# EAGLE design SurfaceEEG_V1.2 (EAGLE 7.7.0)
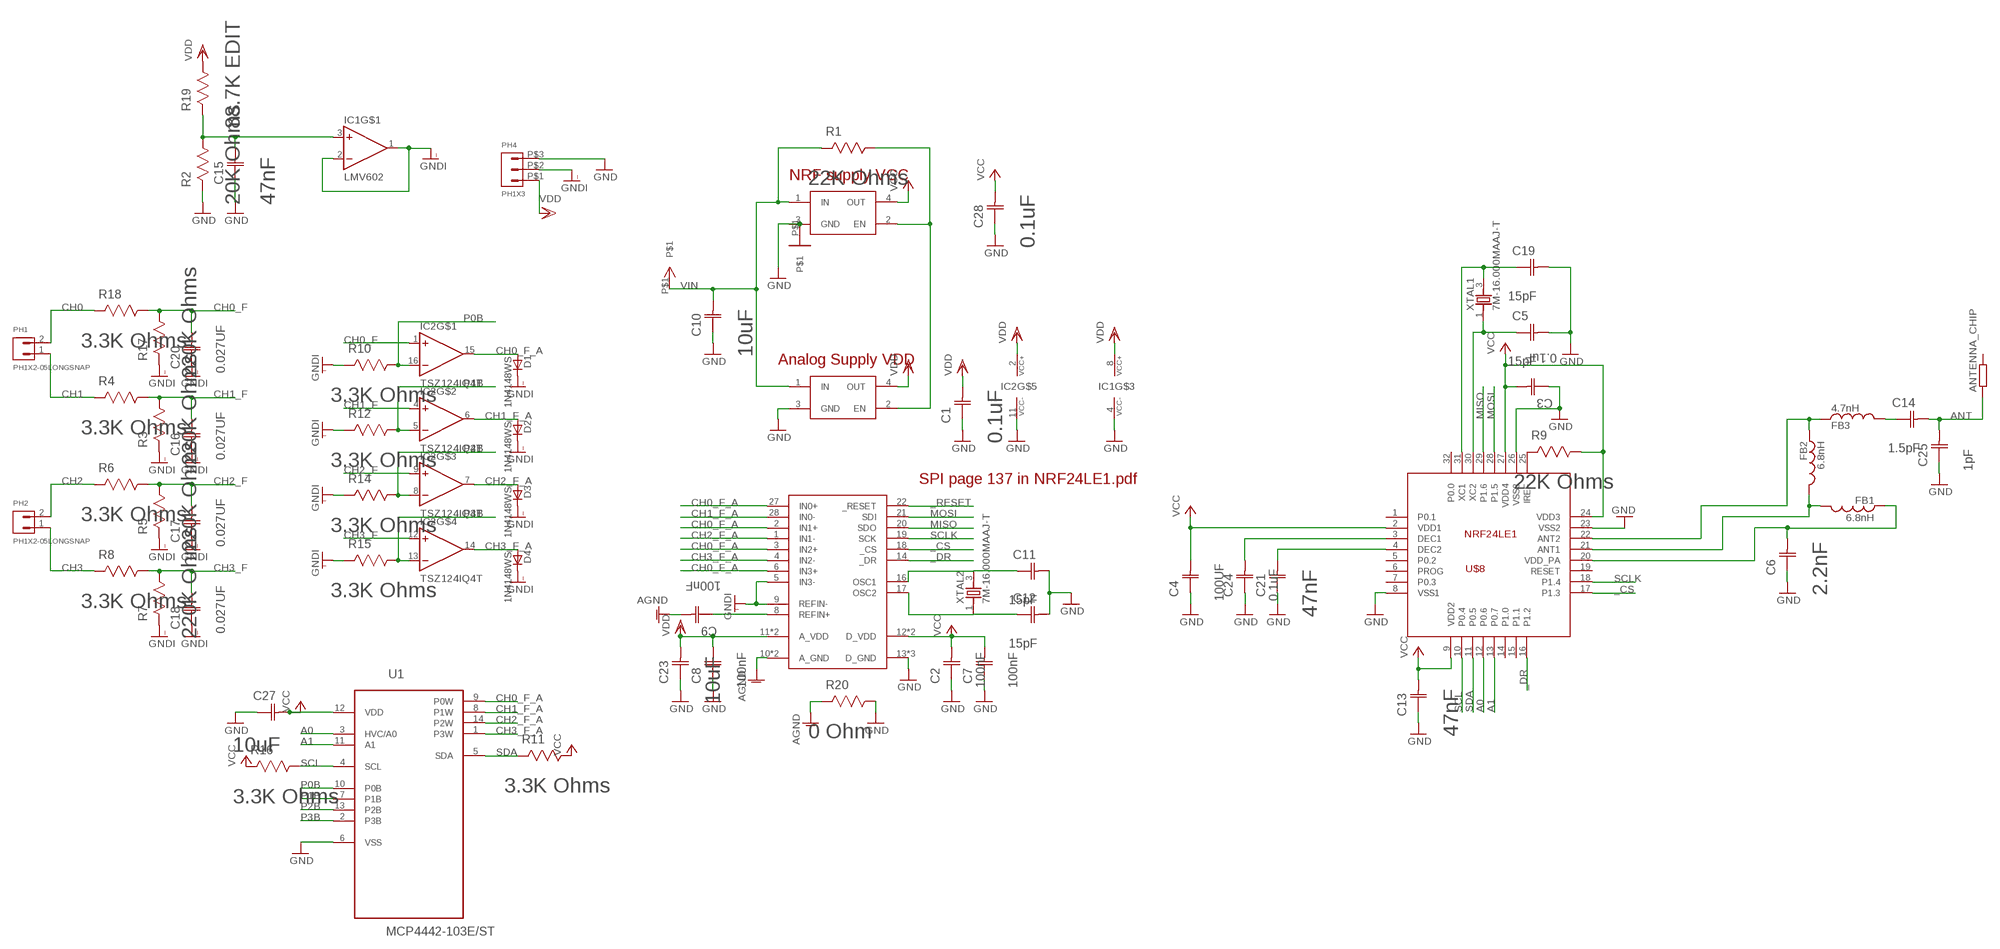
[diagram p0: schematic, sheet 1]

## Parts
ANTENNA_CHIP  R0805  [R0805]
C1  0.1uF  C0603C104K5RAC-TU  [CAPC1608X85N]
C2  100nF  06033C104JAT2A  [CAPC1608X90N]
C3  0.1uF  04023C104KAT2A  [CAPC1005X60N]
C4  100UF  1206YD106MAT2A  [CAPC3216X178N]
C5  15pF  UQCL2A150JAT2A/500  [CAPC1005X60N]
C6  2.2nF  C0402C222K5RACTU  [CAPC1005X60N]
C7  100nF  06033C104JAT2A  [CAPC1608X90N]
C8  100nF  06033C104JAT2A  [CAPC1608X90N]
C9  100nF  06033C104JAT2A  [CAPC1608X90N]
C10  10uF  C0603C106M9PACTU  [CAPC1608X85N]
C11  15pF  UQCL2A150JAT2A/500  [CAPC1005X60N]
C12  15pF  UQCL2A150JAT2A/500  [CAPC1005X60N]
C13  47nF  C0603C473K1RACTU  [CAPC1608X85N]
C14  1.5pF  UQCL2A1R5BAT2A/500  [CAPC1005X60N]
C15  47nF  C0603C473K1RACTU  [CAPC1608X85N]
C16  0.027UF  0603YC273JAT2A  [CAPC1608X90N]
C17  0.027UF  0603YC273JAT2A  [CAPC1608X90N]
C18  0.027UF  0603YC273JAT2A  [CAPC1608X90N]
C19  15pF  UQCL2A150JAT2A/500  [CAPC1005X60N]
C20  0.027UF  0603YC273JAT2A  [CAPC1608X90N]
C21  47nF  C0603C473K1RACTU  [CAPC1608X85N]
C23  10uF  C0603C106M9PACTU  [CAPC1608X85N]
C24  0.1uF  04023C104KAT2A  [CAPC1005X60N]
C25  1pF  UQCL2A1R0BAT2A/500  [CAPC1005X60N]
C27  10uF  C0603C106M9PACTU  [CAPC1608X85N]
C28  0.1uF  C0603C104K5RAC-TU  [CAPC1608X85N]
D1  1N4148WS  [SOD323F]
D2  1N4148WS  [SOD323F]
D3  1N4148WS  [SOD323F]
D4  1N4148WS  [SOD323F]
FB1  6.8nH  FB0402  [FB0402]
FB2  6.8nH  FB0402  [FB0402]
FB3  4.7nH  FB0402  [FB0402]
IC1  LMV602  [VSSOP8]
IC2  TSZ124IQ4T  [QFN16]
PH1  PH1X2-05LONGSNAP  [PHLS005-1-2]
PH2  PH1X2-05LONGSNAP  [PHLS005-1-2]
PH4  PH1X3  [PH005-1-3]
R1  22K Ohms  RC0603FR-0722KL  [RESC1608X60N]
R2  20K Ohms  RC0603FR-0720KL  [RESC1608X60N]
R3  220K Ohms  RC0603FR-07220KL  [RESC1608X60N]
R4  3.3K Ohms  RC0603FR-073K3L  [RESC1608X60N]
R5  220K Ohms  RC0603FR-07220KL  [RESC1608X60N]
R6  3.3K Ohms  RC0603FR-073K3L  [RESC1608X60N]
R7  220K Ohms  RC0603FR-07220KL  [RESC1608X60N]
R8  3.3K Ohms  RC0603FR-073K3L  [RESC1608X60N]
R9  22K Ohms  RC0603FR-0722KL  [RESC1608X60N]
R10  3.3K Ohms  RC0603FR-073K3L  [RESC1608X60N]
R11  3.3K Ohms  RC0603FR-073K3L  [RESC1608X60N]
R12  3.3K Ohms  RC0603FR-073K3L  [RESC1608X60N]
R14  3.3K Ohms  RC0603FR-073K3L  [RESC1608X60N]
R15  3.3K Ohms  RC0603FR-073K3L  [RESC1608X60N]
R16  3.3K Ohms  RC0603FR-073K3L  [RESC1608X60N]
R17  220K Ohms  RC0603FR-07220KL  [RESC1608X60N]
R18  3.3K Ohms  RC0603FR-073K3L  [RESC1608X60N]
R19  88.7K EDIT  RT0603FRE0782KL  [RESC1608X60N]
R20  0 Ohm  9C06031A0R00JLHFT  [RESC1608X60N]
U1  MCP4442-103E/ST  [SOP65P640X120-14N]
U$1  NCP103  [UDFN4-1*1]
U$2  NCP103  [UDFN4-1*1]
U$3  MCP3912  [QFN28]
U$4  VCC  [VCC-PAD]
U$5  GND  [GND-PAD]
U$8  NRF24LE1  [QFN-32]
XTAL1  7M-16.000MAAJ-T  [TXC_7M-16.000MAAJ-T]
XTAL2  7M-16.000MAAJ-T  [TXC_7M-16.000MAAJ-T]

## Nets
_CS: U$3.18(_CS) U$8.17(P1.3)
_DR: U$3.14(_DR) U$8.16(P1.2)
_RESET: U$3.22(_RESET)
A0: U1.3(HVC/A0) U$8.12(P0.6)
A1: U1.11(A1) U$8.13(P0.7)
AGND: C9.2(C2) R20.2(R2) U$3.10(A_GND) U$3.26(A_GND)
ANT: ANTENNA_CHIP.1 C14.1(C2) C25.1(C2)
CH0: PH1.2 R18.2(R2)
CH0_F: C20.2(C2) IC2.1(IN+) R17.1(R1) R18.1(R1)
CH0_F_A: D1.A IC2.15(OUT) U1.9(P0W) U$3.2(IN1+) U$3.3(IN2+) U$3.6(IN3+) U$3.27(IN0+)
CH1: PH1.1 R4.2(R2)
CH1_F: C16.2(C2) IC2.4(IN+) R3.1(R1) R4.1(R1)
CH1_F_A: D2.A IC2.6(OUT) U1.8(P1W) U$3.28(IN0-)
CH2: PH2.2 R6.2(R2)
CH2_F: C17.2(C2) IC2.9(IN+) R5.1(R1) R6.1(R1)
CH2_F_A: D3.A IC2.7(OUT) U1.14(P2W) U$3.1(IN1-)
CH3: PH2.1 R8.2(R2)
CH3_F: C18.2(C2) IC2.12(IN+) R7.1(R1) R8.1(R1)
CH3_F_A: D4.A IC2.14(OUT) U1.1(P3W) U$3.4(IN2-)
GND: C1.1(C1) C2.1(C1) C3.2(C1) C4.1(C1) C5.1(C2) C6.1(C1) C7.1(C1) C8.1(C1) C10.1(C1) C11.1(C2) C12.1(C2) C13.1(C1) C15.1(C1) C19.1(C2) C21.1(C1) C23.1(C1) C24.2(C1) C25.2(C1) C27.1(C1) C28.1(C1) IC1.4(VCC-) IC2.11(VCC-) PH4.P$3 R2.2(R2) R20.1(R1) U1.6(VSS) U$1.3(GND) U$2.3(GND) U$3.13(D_GND) U$3.15(D_GND) U$3.23(D_GND) U$5.P$1 U$8.8(VSS1) U$8.23(VSS2) U$8.26(VSS3)
GNDI: C16.1(C1) C17.1(C1) C18.1(C1) C20.1(C1) D1.C D2.C D3.C D4.C IC1.1(OUT) IC1.2(IN-) PH4.P$2 R3.2(R2) R5.2(R2) R7.2(R2) R10.2(R2) R12.2(R2) R14.2(R2) R15.2(R2) R17.2(R2) U$3.5(IN3-) U$3.9(REFIN-)
MISO: U$3.20(SDO) U$8.29(P1.6)
MOSI: U$3.21(SDI) U$8.28(P1.5)
N$1: FB2.1 FB3.1 U$8.22(ANT2)
N$2: C24.1(C2) U$8.3(DEC1)
N$3: C21.2(C2) U$8.4(DEC2)
N$4: C6.2(C2) FB1.1 U$8.20(VDD_PA)
N$5: R1.1(R1) U$1.2(EN) U$2.2(EN)
N$6: R9.2(R2) U$8.25(IREF)
N$7: FB1.2 FB2.2 U$8.21(ANT1)
N$10: C5.2(C1) U$8.30(XC2) XTAL1.1
N$11: C19.2(C1) U$8.31(XC1) XTAL1.3
N$12: C9.1(C1) U$3.8(REFIN+)
N$14: C11.2(C1) U$3.16(OSC1) XTAL2.3
N$15: C12.2(C1) U$3.17(OSC2) XTAL2.1
N$18: C15.2(C2) IC1.3(IN+) R2.1(R1) R19.2(R2)
N$22: C14.2(C1) FB3.2
P0B: IC2.16(IN-) R10.1(R1) U1.10(P0B)
P1B: IC2.5(IN-) R12.1(R1) U1.7(P1B)
P2B: IC2.8(IN-) R14.1(R1) U1.13(P2B)
P3B: IC2.13(IN-) R15.1(R1) U1.2(P3B)
SCL: R16.1(R1) U1.4(SCL) U$8.10(P0.4)
SCLK: U$3.19(SCK) U$8.18(P1.4)
SDA: R11.2(R2) U1.5(SDA) U$8.11(P0.5)
VCC: C2.2(C2) C3.1(C2) C4.2(C2) C7.2(C2) C13.2(C2) C27.2(C2) C28.2(C2) R9.1(R1) R11.1(R1) R16.2(R2) U1.12(VDD) U$1.4(OUT) U$3.12(D_VDD) U$3.24(D_VDD) U$8.2(VDD1) U$8.9(VDD2) U$8.24(VDD3) U$8.27(VDD4)
VDD: C1.2(C2) C8.2(C2) C23.2(C2) IC1.8(VCC+) IC2.2(VCC+) PH4.P$1 R19.1(R1) U$2.4(OUT) U$3.11(A_VDD) U$3.25(A_VDD)
VIN: C10.2(C2) R1.2(R2) U$1.1(IN) U$2.1(IN) U$4.P$1
Unconnected: ANTENNA_CHIP.2 IC1.5(IN+) IC1.6(IN-) IC1.7(OUT) U$8.1(P0.1) U$8.5(P0.2) U$8.6(PROG) U$8.7(P0.3) U$8.14(P1.0) U$8.15(P1.1) U$8.19(RESET) U$8.32(P0.0)

## Notes on the sheet
- NRF supply VCC
- Analog Supply VDD
- SPI page 137 in NRF24LE1.pdf

## Library data of the parts
ANTENNA_CHIP = ELL-i-Passives:R: Surface Mount Resistor — in standard sizes
C1 C28 = (manufact)-Kemet-element14:C0603C104K5RAC-TU: CAPACITOR, 0603; MPN: C0603C104K5RAC-TU; OC_FARNELL: 1692286; OC_NEWARK: 97H5226; SUPPLIER: Kemet; TOLERANCE: ±10%; VOLTAGERATING: 50V
C2 C7-C9 = (manufact)-capacitors-AVX-element14:06033C104JAT2A: Capacitor 0603; MPN: 06033C104JAT2A; OC_FARNELL: 1740614; OC_NEWARK: 60R6215; SUPPLIER: AVX; TOLERANCE: ±5%; VOLTAGERATING: 25V
C3 C24 = (manufact)-capacitors-AVX-element14:04023C104KAT2A: Capacitor 0402; MPN: 04023C104KAT2A; OC_FARNELL: 1867948; OC_NEWARK: 37T9047; SUPPLIER: AVX; TOLERANCE: ±10%; VOLTAGERATING: 25V
C4 = (manufact)-capacitors-AVX-element14:1206YD106MAT2A: Capacitor 1206; MPN: 1206YD106MAT2A; OC_FARNELL: 1582746; OC_NEWARK: 96M1430; SUPPLIER: AVX; TOLERANCE: ±20%; VALUE: 10UF; VOLTAGERATING: 16V
C5 C11 C12 C19 = (manufact)-capacitors-AVX-element14:UQCL2A150JAT2A/500: Capacitor 0402; MPN: UQCL2A150JAT2A/500; OC_FARNELL: -; OC_NEWARK: 32T8795; SUPPLIER: AVX; TOLERANCE: ±5%; VOLTAGERATING: 200V
C6 = (manufact)-Kemet-element14:C0402C222K5RACTU: CAPACITOR, 0402; MPN: C0402C222K5RACTU; OC_FARNELL: 1414582; OC_NEWARK: 70K9080; SUPPLIER: Kemet; TOLERANCE: ±10%; VOLTAGERATING: 50V
C10 C23 C27 = (manufact)-Kemet-element14:C0603C106M9PACTU: CAPACITOR, 0603; MPN: C0603C106M9PACTU; OC_FARNELL: 1288201; OC_NEWARK: 93K5998; SUPPLIER: Kemet; TOLERANCE: ±20%; VOLTAGERATING: 6.3V
C13 C15 C21 = (manufact)-Kemet-element14:C0603C473K1RACTU: CAPACITOR, 0603; MPN: C0603C473K1RACTU; OC_FARNELL: 1865550; OC_NEWARK: 29T9032; SUPPLIER: KEMET; TOLERANCE: ±10%; VOLTAGERATING: 100V
C14 = (manufact)-capacitors-AVX-element14:UQCL2A1R5BAT2A/500: Capacitor 0402; MPN: UQCL2A1R5BAT2A/500; OC_FARNELL: -; OC_NEWARK: 32T8784; SUPPLIER: AVX; TOLERANCE: ±.1 pF; VOLTAGERATING: 200V
C16-C18 C20 = (manufact)-capacitors-AVX-element14:0603YC273JAT2A: Capacitor, 0603; MPN: 0603YC273JAT2A; OC_FARNELL: -; OC_NEWARK: 55J2671; SUPPLIER: AVX; TOLERANCE: ±5%; VOLTAGERATING: 16V
C25 = (manufact)-capacitors-AVX-element14:UQCL2A1R0BAT2A/500: Capacitor 0402; MPN: UQCL2A1R0BAT2A/500; OC_FARNELL: -; OC_NEWARK: 32T8778; SUPPLIER: AVX; TOLERANCE: ±.1 pF; VOLTAGERATING: 200V
D1-D4 = (misc)-parts-that-we-use:1N4148WS: 1N4148 General Purpose Rectifie SMD-Version of 1N4148 Case: SOD 323 F Author: Dipl.-Ing. FH Rainer Bayer HHN Hochschule Heilbronn, rainer.bayer@hs-heilbronn.de Ingenieurbüro ing-rb, mail@ing-rb.de
FB1-FB3 = ELL-i-Passives:FB: Ferrite beads Ferrite beads are choke coils used to suppress high frequency noise in electronic circuits. Wikipedia article on ferrite beads <https://en.wikipedia.org/wiki/Ferrite_bead>
IC1 = (custom)-new-components:LMV602: The library has been designed by Richard Magdycz <https://www.facebook.com/groups/eaglecadsoftUK>; MPN: LMV602MM/NOPB
IC2 = (user-cadsoft)-st-microelectronics-tsz12x:TSZ124: The library has been designed by Richard Magdycz <https://www.facebook.com/groups/eaglecadsoftUK>
PH1 PH2 = pel_hdr:PH1X2
PH4 = (misc)-parts-that-we-use:PH1X3
R1 R9 = (manufact)-resistors-YAGEO-element14:RC0603FR-0722KL: RESISTOR, 0603; MPN: RC0603FR-0722KL; OC_FARNELL: 1117251; OC_NEWARK: 68R0072; SUPPLIER: Yageo; TOLERANCE: ±1%; WATTAGE: 1/10 W
R2 = (manufact)-resistors-YAGEO-element14:RC0603FR-0720KL: RESISTOR, 0603; MPN: RC0603FR-0720KL; OC_FARNELL: 1799331; OC_NEWARK: 05R9835; SUPPLIER: Yageo; TOLERANCE: ±1%; WATTAGE: 1/10 W
R3 R5 R7 R17 = (manufact)-resistors-YAGEO-element14:RC0603FR-07220KL: RESISTOR, 0603; MPN: RC0603FR-07220KL; OC_FARNELL: 1117252; OC_NEWARK: 68R0074; SUPPLIER: Yageo; TOLERANCE: ±1%; WATTAGE: 1/10 W
R4 R6 R8 R10-R12 R14-R16 R18 = (manufact)-resistors-YAGEO-element14:RC0603FR-073K3L: RESISTOR, 0603; MPN: RC0603FR-073K3L; OC_FARNELL: 1117258; OC_NEWARK: 68R0079; SUPPLIER: Yageo; TOLERANCE: ±1%; WATTAGE: 1/10 W
R19 = (manufact)-resistors-YAGEO-element14:RT0603FRE0782KL: RESISTOR, 0603; MPN: RT0603FRE0782KL; OC_FARNELL: 1500658; OC_NEWARK: -; SUPPLIER: Yageo; TOLERANCE: ±1%; VALUE: 82K Ohms; WATTAGE: 1/10 W
R20 = (manufact)-resistors-YAGEO-element14:9C06031A0R00JLHFT: RESISTOR, 0603; MPN: 9C06031A0R00JLHFT; OC_FARNELL: -; OC_NEWARK: 68H9772; SUPPLIER: Yageo; TOLERANCE: ±5%; WATTAGE: 0.1 W
U1 = (manufact)-Microchip-MCP44-farnell:MCP44: 7/8-Bit Quad I2C Digital POT,TSSOP-14; MPN: MCP4442-103E/ST; OC_FARNELL: 1855446; OC_NEWARK: 91R2864; PACKAGE: TSSOP-14; SUPPLIER: MICROCHIP
U$1 U$2 = (custom)-new-components:NCP103: NCP103AMX330TCG 3.3V LDO: 75mV dropout, 150 mA http://www.onsemi.com/pub_link/Collateral/NCP103-D.PDF; MPN: NCP103AMX330TCG
U$3 = (custom)-new-components:MCP3912; MPN: MCP3912A1-E/MQ
U$4 = (custom)-new-components:VCC
U$5 = (custom)-new-components:GND
U$8 = (misc)-parts-that-we-use:NRF24LE1: 2.4GHz transceiver; MPN: NRF24LE1-F16Q24-T
XTAL1 XTAL2 = (misc)-parts-that-we-use:7M-16.000MAAJ-T: CRYSTAL SEAM, 16MHZ, 18PF, SMD; MPN: 7M-16.000MAAJ-T; OC_FARNELL: 1842060; OC_NEWARK: 84R5710; PACKAGE: SMD; SUPPLIER: TXC

## Board
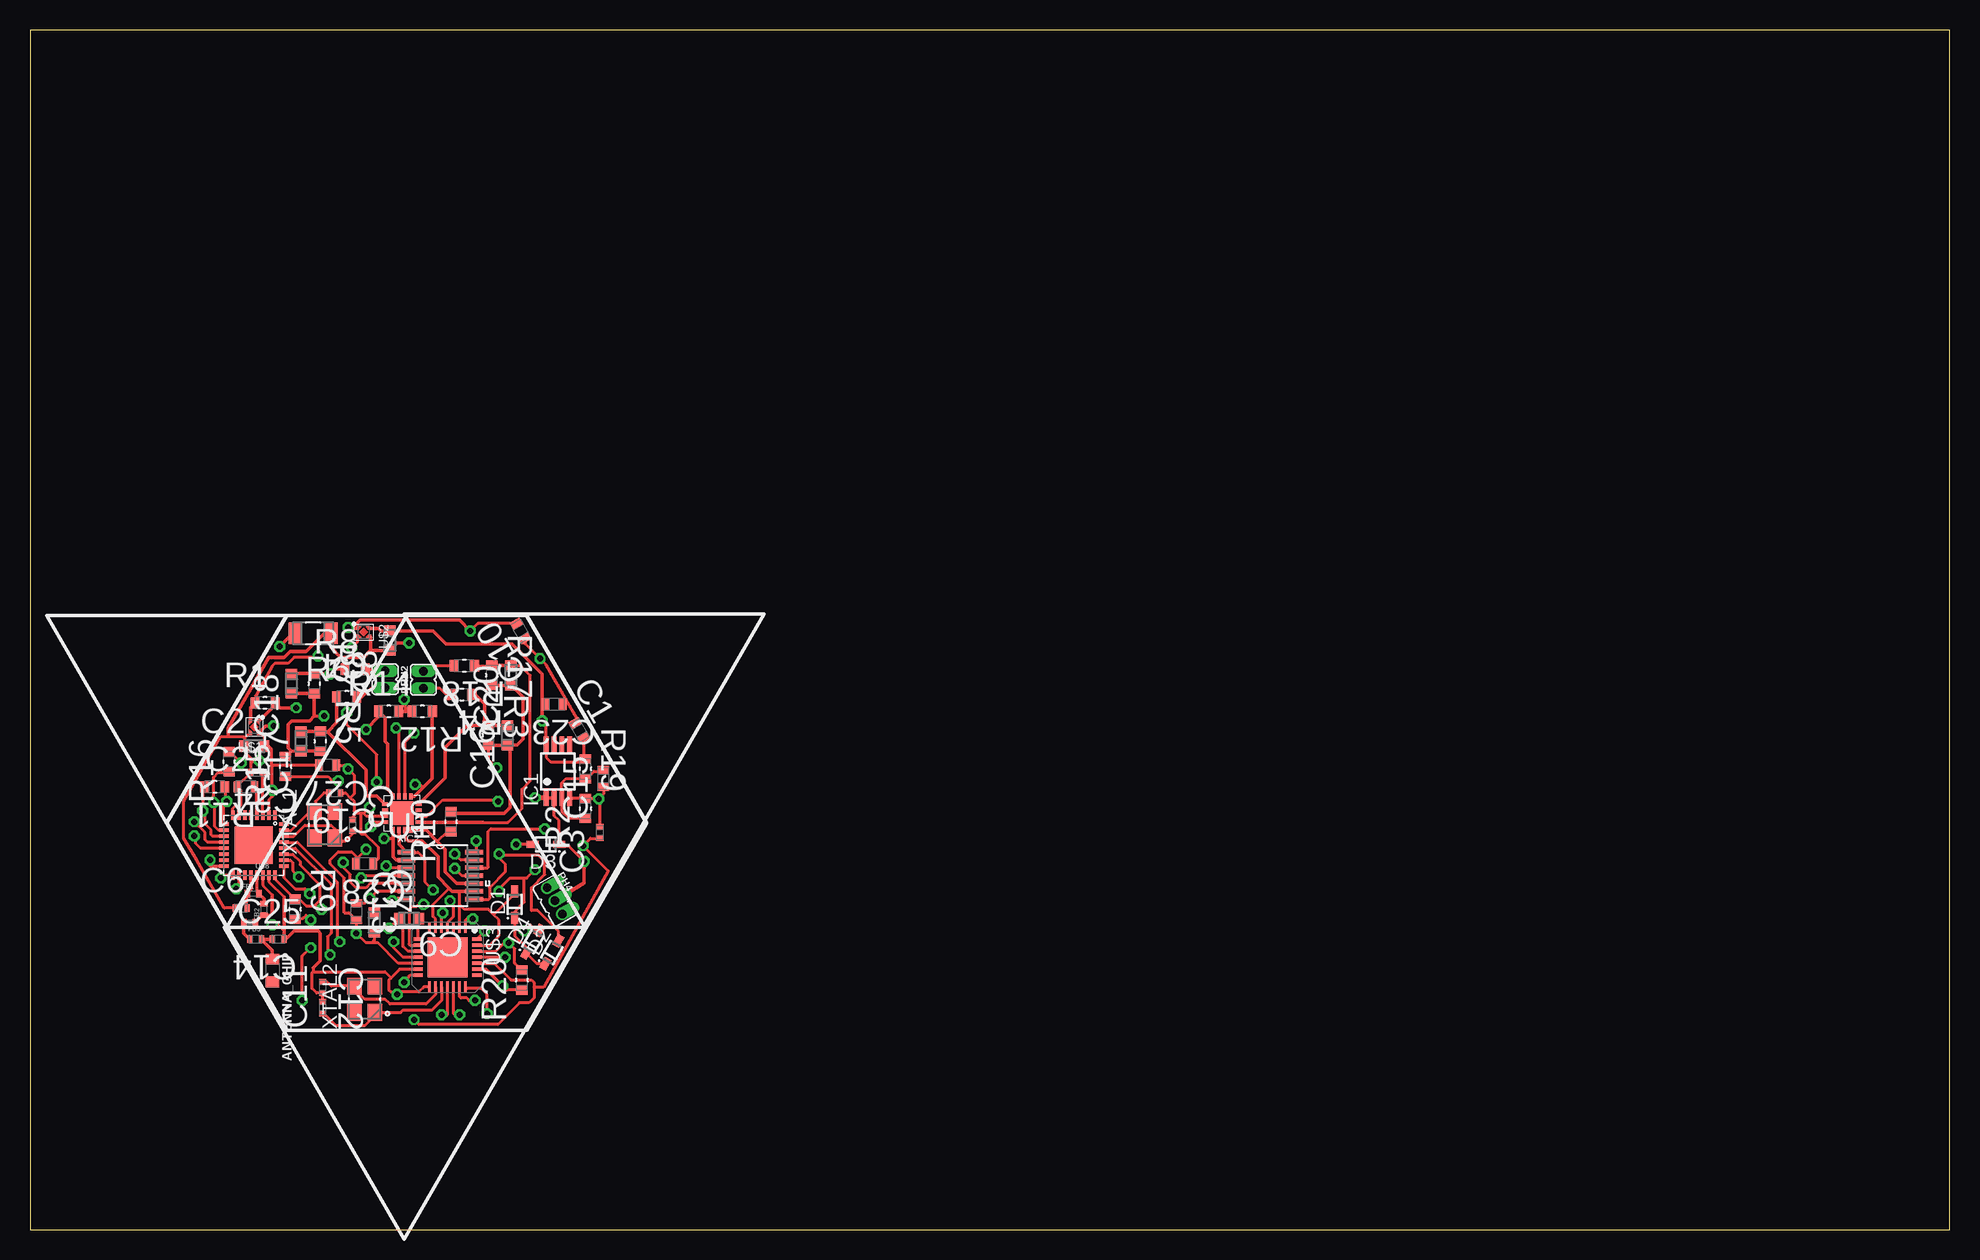
[diagram p1: board, top side]
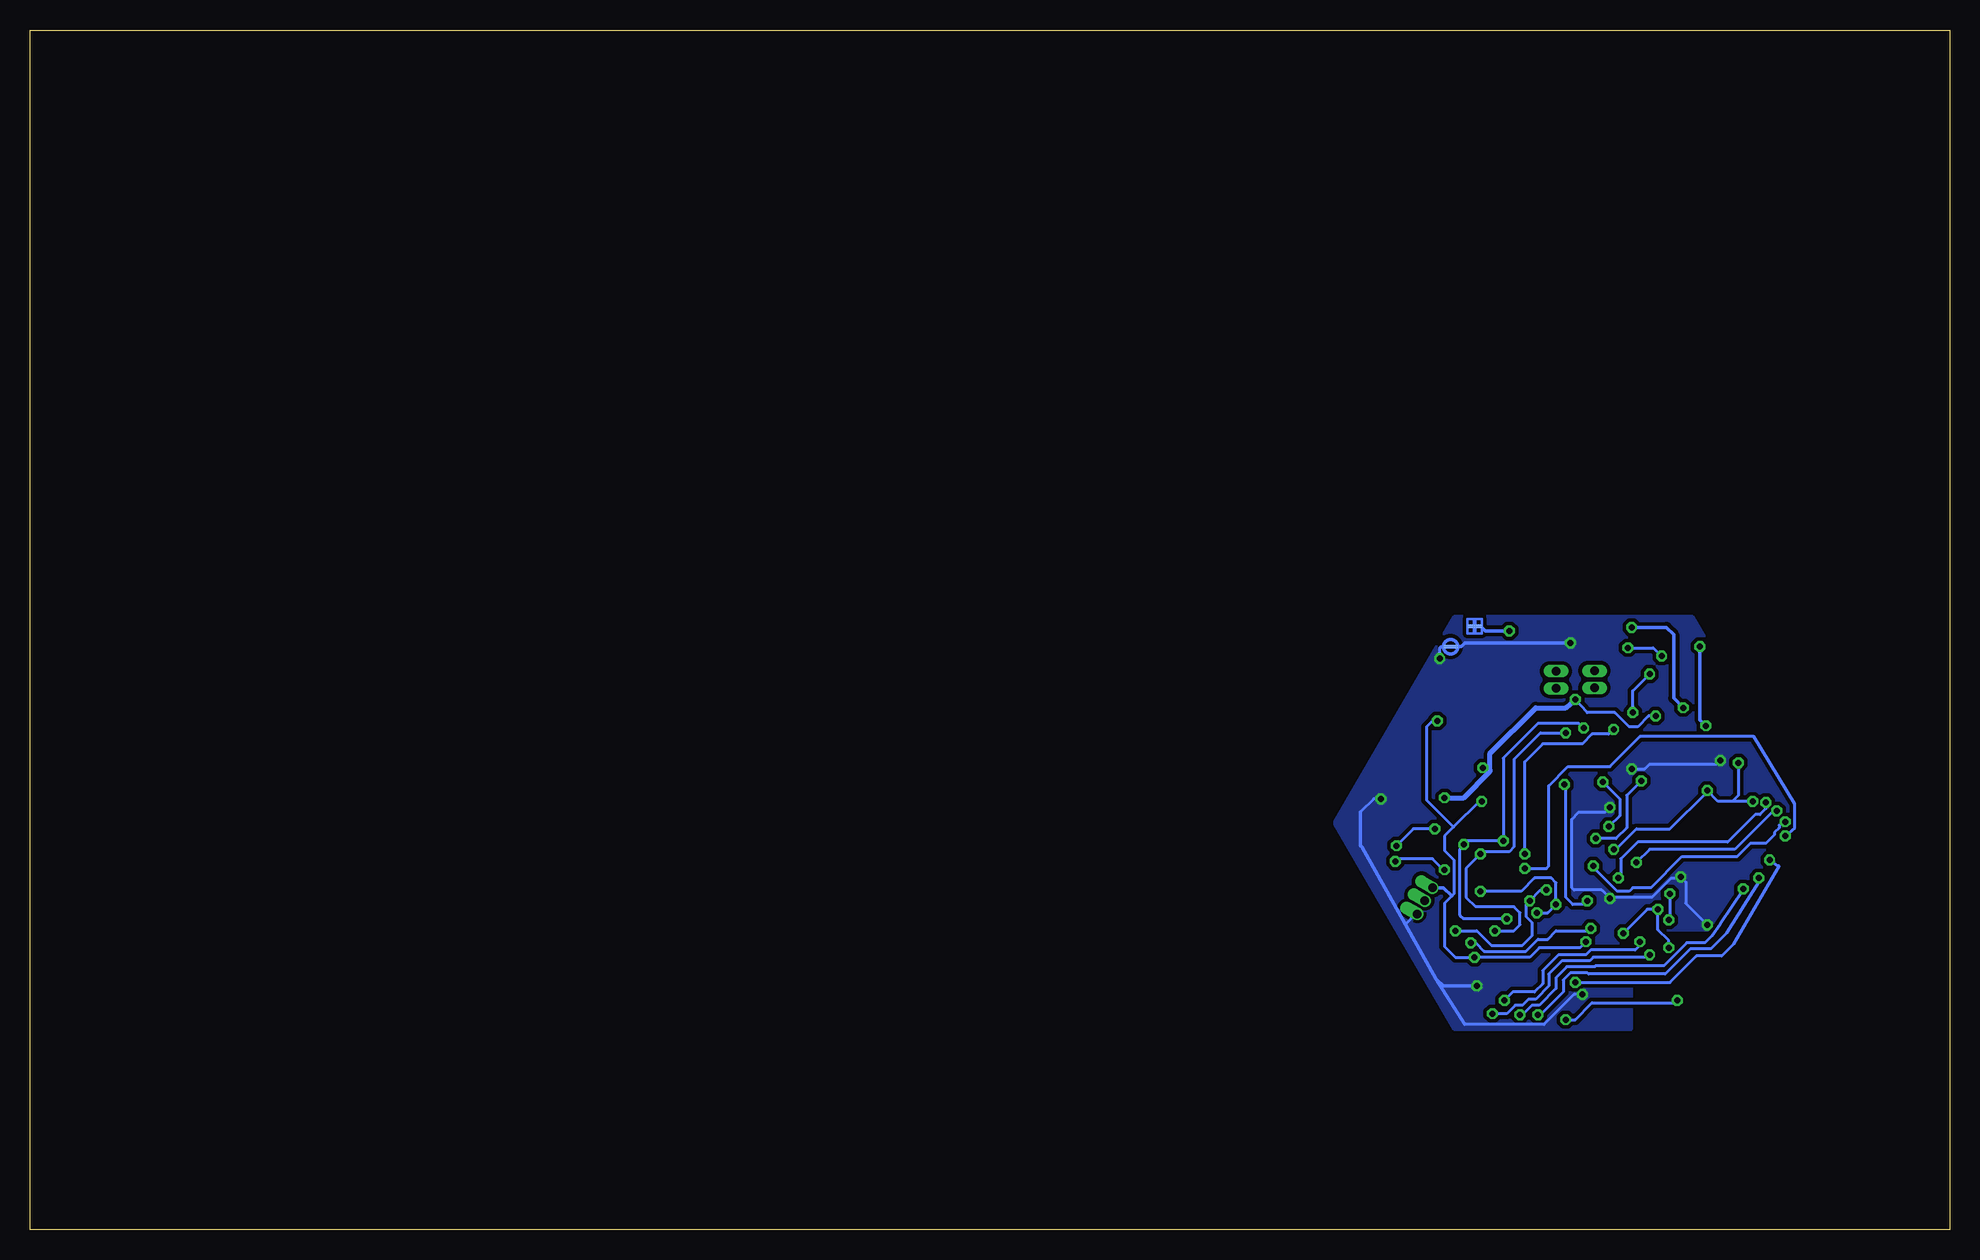
[diagram p2: board, bottom side, seen from below]

Size 160 x 100 mm. Coordinates in mm from the lower left corner, seen from the top.
Outline: 0,0 160,0 160,100 0,100 0,0
Copper layers (1*16): Top 0.035mm / dielectric 1.5mm / Bottom 0.035mm
Design rules "default *": minimum track width 10mil, minimum drill 24mil, track to track 0.15mm, track to pad 0.15mm, pad to pad 0.15mm, via to via 0.15mm, smd to smd 0.15mm, copper to edge 40mil, drill to drill 0.2mm, minimum pad ring 6mil, minimum via ring 8mil, stop-mask expansion 4mil, vias tented up to drill 0mil, thermal gap 10mil

### Footprints (pad centres in the part's own frame; a part is rotated, then mirrored left to right if it is on the bottom)
R0805 = smd 0.9 x 1.1: 1 -0.95,0; 2 0.95,0
CAPC1608X85N = smd 0.66 x 0.94: 1 -0.711,0; 2 0.711,0
CAPC1608X90N = smd 0.864 x 0.965: 1 -0.813,0; 2 0.813,0
CAPC1005X60N = smd 0.457 x 0.61: 1 -0.483,0; 2 0.483,0
CAPC3216X178N = smd 1.118 x 1.803: 1 -1.499,0; 2 1.499,0
SOD323F = smd 1 x 0.6: A 1.1,0; C -1.1,0
FB0402 = smd 0.45 x 0.6: 1 -0.475,0; 2 0.475,0
VSSOP8 = smd 1.4 x 0.4: 1 -2.2,0.975; 2 -2.2,0.325; 3 -2.2,-0.325; 4 -2.2,-0.975; 5 2.2,-0.975; 6 2.2,-0.325; 7 2.2,0.325; 8 2.2,0.975
QFN16 = smd 0.5 x 0.3: 1 -1.4,0.75; 2 -1.4,0.25; 3 -1.4,-0.25; 4 -1.4,-0.75; 9 1.4,-0.75; 10 1.4,-0.25; 11 1.4,0.25; 12 1.4,0.75 | smd 0.3 x 0.5: 5 -0.75,-1.4; 6 -0.25,-1.4; 7 0.25,-1.4; 8 0.75,-1.4; 13 0.75,1.4; 14 0.25,1.4; 15 -0.25,1.4; 16 -0.75,1.4 | smd 1.95 x 1.95: EXP 0,0
PHLS005-1-2 = drill 0.7 pad 1.016 long: 1 -0.076,0; 2 1.346,0
PH005-1-3 = drill 0.7 pad 1.016 offset: P$1 0,0; P$2 1.27,0; P$3 2.54,0
RESC1608X60N = smd 0.762 x 0.94: 1 -0.838,0; 2 0.838,0
SOP65P640X120-14N = smd 1.473 x 0.356: 1 -2.819,1.956; 2 -2.819,1.295; 3 -2.819,0.66; 4 -2.819,0; 5 -2.819,-0.66; 6 -2.819,-1.295; 7 -2.819,-1.956; 8 2.819,-1.956; 9 2.819,-1.295; 10 2.819,-0.66; 11 2.819,0; 12 2.819,0.66; 13 2.819,1.295; 14 2.819,1.956
UDFN4-1*1 = smd 0.2 x 0.2: 1 -0.325,-0.525; 2 0.325,-0.525; 3 0.325,0.525; 4 -0.325,0.525
QFN28 = smd 0.85 x 0.3: 1 -2.45,1.5; 2 -2.45,1; 3 -2.45,0.5; 4 -2.45,0; 5 -2.45,-0.5; 6 -2.45,-1; 7 -2.45,-1.5; 15 2.45,-1.5; 16 2.45,-1; 17 2.45,-0.5; 18 2.45,0; 19 2.45,0.5; 20 2.45,1; 21 2.45,1.5 | smd 0.3 x 0.85: 8 -1.5,-2.45; 9 -1,-2.45; 10 -0.5,-2.45; 11 0,-2.45; 12 0.5,-2.45; 13 1,-2.45; 14 1.5,-2.45; 22 1.5,2.45; 23 1,2.45; 24 0.5,2.45; 25 0,2.45; 26 -0.5,2.45; 27 -1,2.45; 28 -1.5,2.45 | smd 3.35 x 3.35: M 0,0
VCC-PAD = smd 1.2 x 0.3: P$1 0,0
GND-PAD = smd 1.2 x 0.3: P$1 0,0
QFN-32 = smd 0.285 x 0.8: 1 -1.75,-2.5; 2 -1.25,-2.5; 3 -0.75,-2.5; 4 -0.25,-2.5; 5 0.25,-2.5; 6 0.75,-2.5; 7 1.25,-2.5; 8 1.75,-2.5; 17 1.75,2.5; 18 1.25,2.5; 19 0.75,2.5; 20 0.25,2.5; 21 -0.25,2.5; 22 -0.75,2.5; 23 -1.25,2.5; 24 -1.75,2.5 | smd 0.8 x 0.285: 9 2.5,-1.75; 10 2.5,-1.25; 11 2.5,-0.75; 12 2.5,-0.25; 13 2.5,0.25; 14 2.5,0.75; 15 2.5,1.25; 16 2.5,1.75; 25 -2.5,1.75; 26 -2.5,1.25; 27 -2.5,0.75; 28 -2.5,0.25; 29 -2.5,-0.25; 30 -2.5,-0.75; 31 -2.5,-1.25; 32 -2.5,-1.75 | smd 3.15 x 3.15: EP 0,0
TXC_7M-16.000MAAJ-T = smd 1.4 x 1.2: 1 -1.1,-0.85; 2 1.1,-0.85; 3 1.1,0.85; 4 -1.1,0.85

### Placement (x,y rotation side)
ANTENNA_CHIP  20.2,21.6 270 top
C1  45.8,41.6 300 top
C2  18.7,40.3 0 top
C3  47.5,33.1 90 top
C4  23.6,49.7 180 top
C5  26.9,33.7 270 top
C6  17.6,26.8 0 top
C7  28.7,25.6 270 top
C8  30,49.1 90 top
C9  31.6,25.9 180 top
C10  40.9,49.9 120 top
C11  24.4,20.2 90 top
C12  24.4,18.5 270 top
C13  27.2,26.5 270 top
C14  18.8,24.2 180 top
C15  47.8,37.6 90 top
C16  39.8,41.2 90 top
C17  22.6,40.7 90 top
C18  21.8,45.5 90 top
C19  25.4,36.4 180 top
C20  40.1,46.2 90 top
C21  18,36.9 0 top
C23  43.7,43.8 180 top
C24  18.9,38.1 180 top
C25  20.7,24.2 0 top
C27  24.8,38.7 180 top
C28  27.9,30.5 180 top
D1  40.4,27.1 90 top
D2  43.5,23.1 60 top
D3  43,32.1 180 top
D4  41.9,24 60 top
FB1  18.6,28 0 top
FB2  19.5,26.7 90 top
FB3  18.3,25.6 180 top
IC1  44,38.2 90 top
IC2  31,34.7 180 top
PH1  32.8,45.2 90 top
PH2  29.6,46.5 270 top
PH4  43.1,28.5 300 top
R1  19.6,43.9 0 top
R2  46.3,35.1 90 top
R3  38.2,41.2 270 top
R4  36,44.6 180 top
R5  24.2,40.7 270 top
R6  26.4,44.4 0 top
R7  23.7,45.5 270 top
R8  27.1,46.7 0 top
R9  22.1,26.7 270 top
R10  35.1,34 90 top
R11  15.4,36.9 180 top
R12  32.7,43.2 180 top
R14  29.9,43.2 0 top
R15  21.3,38.6 90 top
R16  16.6,39 90 top
R17  38.5,46.2 270 top
R18  36.2,47 180 top
R19  46.3,38.4 270 top
R20  41,20.8 90 top
U1  34.2,29.5 0 top
U$1  18.7,41.9 180 top
U$2  27.8,49.8 270 top
U$3  34.8,22.7 270 top
U$4  39.6,50.3 0 bottom
U$5  41.6,48.6 0 bottom
U$8  18.65,32.04 180 top
XTAL1  24.55,33.74 90 top
XTAL2  27.9,19.2 90 top

### Tracks (layer width: path | path; a pad name or v marks a point on that pad's centre or on a via)
_CS  (via drill 0.5 pad 0.61)
  Top 0.254: U$8.17 16.14,29.54 v15.9,29.3 | v34.3,17.9 34.8,17.9 U$3.18
  Bottom 0.254: v15.9,29.3 15.9,29 18.6,24.7 19.9,23.4 21.6,23.4 23.7,21.3 30.1,21.3 30.2,21.4 31.6,21.4 32.2,20.8 32.2,19.8 34.1,17.9 v34.3,17.9
_DR  (via drill 0.5 pad 0.61)
  Top 0.254: U$3.14 31.7,21.2 v31.2,20.6 | 15.99,30.29 U$8.16 15.01,30.29 15.01,30.59 v15,30.8
  Bottom 0.254: v31.2,20.6 23.3,20.6 21.1,22.8 19,22.8 18,23.8 14.2,30.3 14.3,30.3 v15,30.8
A0  (via drill 0.5 pad 0.61)
  Top 0.254: v13.7,34 14.6,33.1 14.6,32.5 14.81,32.29 U$8.12 | U1.3 29.84,30.16 v29.7,30.3
  Bottom 0.254: v13.7,34 13.9,34 14.2,33.7 14.2,33.5 14.6,33.1 14.6,32.9 15.3,32.2 16.6,32.2 17.7,31.1 22.3,31.1 24.9,28.5 26.4,28.5 26.7,28.2 27.7,28.2 29.4,29.9 29.4,30 v29.7,30.3
A1  (via drill 0.5 pad 0.61)
  Top 0.254: U1.11 36,29.5 v35.4,30.1 | v13.7,32.8 13.8,32.6 13.8,32.2 14.21,31.79 U$8.13
  Bottom 0.254: v35.4,30.1 33.6,30.1 33.4,30.3 33.4,37 31.8,38.6 28.3,38.6 25.8,41.1 16.3,41.1 12.9,35.5 12.9,33.5 v13.7,32.8
AGND  (via drill 0.5 pad 0.61)
  Top 0.254: 30.6,26.2 30.6,25.61 C9.2 | U$3.26 38.8,23.2 39.5,23.9 v39.9,23.9 40.4,23.4 40.4,22.2 40.76,21.84 40.8,21.84 R20.2 | C9.2 30.8,25.91 30.71,25.91 v29.9,25.1 | U$3.10 31.5,23.2 31.1,23.6 31.1,25.59 C9.2
  Bottom 0.254: v39.9,23.9 39.5,23.9 38.8,23.2 35.3,23.2 34.3,24.2 33.5,24.2 32.8,24.9 30.1,24.9 v29.9,25.1
ANT
  Top 0.305: C25.1 C14.1 20.2,23.28 ANTENNA_CHIP.1
CH0
  Top 0.254: R18.2 33.25,47 PH1.2
CH0_F
  Top 0.254: 37.79,33.95 39.85,33.95 41,35.1 41,36.7 41.7,37.4 41.7,46.2 40.9,47 40.11,47 C20.2 | R18.1 38.46,47 R17.1
  Top 0.305: IC2.1 37.79,33.95 | 38.36,46.9 R17.1 40.08,47.04 C20.2
CH0_F_A
  Top 0.254: U$3.3 U$3.2 35.8,27.1 | 35.8,27.1 35.8,28.11 35.7,28.2 | U$3.6 33.8,25.9 33.6,26.1 33.6,27.1 34.95,28.45 | U$3.27 38.3,23.7 39.1,24.5 39.1,25.8 38.65,26.25 | 38.65,26.25 38.2,26.7 36.2,26.7 35.8,27.1 | D1.A 40.4,28 38.65,26.25
  Top 0.305: U1.9 35.7,28.2 35.2,28.2 34.95,28.45 34,29.4 34,31.1 32.7,32.4 31.5,32.4 31.25,32.65 IC2.15
CH1
  Top 0.254: R4.2 34.7,44.6 34.2,45.1 32.82,45.1 PH1.1
CH1_F
  Top 0.305: R4.1 37.1,44.6 37.9,43.8 37.9,42.34 R3.1 | R3.1 39.77,42.04 C16.2 | R3.1 36.44,42.04 34.6,40.2 34.6,37.65 IC2.4
CH1_F_A  (via drill 0.5 pad 0.61)
  Top 0.254: U1.8 37.06,27.5 38.2,27.5 38.3,27.6 38.3,28.5 39.6,29.8 39.6,30.5 39.1,31 v39.1,31.3 39.2,31.2 42.4,31.2 42.9,30.7 42.9,29.6 41.8,28.5 41.8,26.6 42.3,26.6 44.05,24.85 D2.A | U$3.28 37.25,24.25 v37.9,24.9 | IC2.6 31.25,40.65 v32,41.4
  Bottom 0.254: v37.9,24.9 36.3,24.9 35.8,25.4 35.8,26.4 36.3,26.9 39.5,26.9 40.3,27.7 40.3,30.1 v39.1,31.3 38.9,31.5 36.7,31.5 36.3,31.9 36.3,39.2 34.1,41.4 v32,41.4
CH2
  Top 0.254: R6.2 27.7,44.4 28.4,45.1 29.55,45.1 PH2.2
CH2_F
  Top 0.305: C17.2 24.18,41.51 R5.1 24.24,41.5 24.8,41.5 | IC2.9 28.9,36.15 28.15,36.15 28,36.3 28,38.3 24.8,41.5 | R6.1 25.56,42.26 24.8,41.5
CH2_F_A  (via drill 0.5 pad 0.61)
  Top 0.254: IC2.7 30.75,41.55 v30.5,41.8 | v37.2,32.4 37.2,31.64 U1.14 | U$3.1 36.3,25.8 36.4,25.9 v36.9,25.9 | D3.A v40.5,32.1
  Bottom 0.254: v30.5,41.8 30.9,42.2 34.3,42.2 37.2,39.3 v37.2,32.4 40.2,32.4 v40.5,32.1 40.5,32 40.8,31.7 40.8,26.2 40.5,25.9 v36.9,25.9
CH3
  Top 0.254: R8.2 29.48,46.7 PH2.1
CH3_F  (via drill 0.5 pad 0.61)
  Top 0.254: IC2.12 28.65,33.95 28.65,33.85 v28.4,33.6 | v28.9,37.3 28.9,39.6 26.4,42.1 v26.4,43.1 | R8.1 25.4,46.7 v25,46.3 24.96,46.34 R7.1
  Top 0.305: R7.1 21.82,46.34 C18.2
  Bottom 0.254: v28.9,37.3 27.5,35.9 27.5,34.5 v28.4,33.6 | v26.4,43.1 26.4,44.9 v25,46.3
CH3_F_A  (via drill 0.5 pad 0.61)
  Top 0.254: U1.1 32.34,31.46 32.9,30.9 32.9,29 v33.6,28.3 | U$3.4 34.8,25.6 35.3,26.1 35.3,27.1 v35,27.4 | v41.2,24.9 41.7,25.4 42.15,24.95 D4.A
  Top 0.305: IC2.14 30.75,32.09 U1.1
  Bottom 0.254: v41.2,24.9 39.4,24.9 38.2,23.7 35.6,23.7 34.8,24.5 34.8,25.6 35.3,26.1 35.3,27.1 v35,27.4 34.1,28.3 v33.6,28.3
GND  (via drill 0.5 pad 0.61)
  Top 0.254: C6.1 16.2,26.8 13.9,30.8 12.8,32.6 12.8,35.7 15.9,41.1 16.6,41.1 17.8,41.1 17.9,41 | U$8.26 21.71,30.79 21.9,30.6 21.9,29.9 v22.4,29.4 | IC2.11 28.05,34.45 27.8,34.7 | 27.8,34.7 27.6,34.7 | 27.6,34.7 27.19,34.7 | U$3.15 32.85,20.25 32.4,19.8 30.8,19.8 v30.6,19.6 30.4,19.8 30.1,19.8 29.9,20 29.9,20.8 30.1,21 | U$3.13 30.8,21.7 30.1,21 | v20.2,25.4 20.68,25.4 21.18,24.9 | 23.59,21.49 23.6,21.5 29.6,21.5 30.1,21 | U$8.8 16.9,35.1 17.1,35.3 17.5,35.3 17.6,35.4 17.6,36.59 C21.1 17.29,36.97 C24.2 18.4,38.12 18.4,38.8 | U1.6 28.91,28.2 28.7,28 | v28.3,35.2 27.8,34.7 | 28.7,28 v28.3,27.6 27.91,27.21 C13.1 | C12.1 C11.1 23.88,19.72 23.5,20.1 23.5,21.4 23.59,21.49 | 23.59,21.79 23.59,21.49 | C5.1 26.9,34.41 27.19,34.7 | C19.1 26.3,36.4 26.7,36 | 26.7,36 27,35.7 27,34.89 27.19,34.7 | IC1.4 46.24,36 R2.2 47.36,35.94 v47.4,35.9 | C15.1 47.8,36.3 v47.4,35.9 | C2.1 17.7,40.1 17.7,40 | U$1.3 18.27,41.38 17.9,41 | 17.9,41 17.9,40.11 C2.1 | R20.1 39.74,19.96 v39.4,20.3 | C7.1 28.7,28 | 18.4,38.8 18.4,39.3 17.9,39.8 17.9,40.29 C2.1 | C10.1 41.26,48.84 v42.5,47.6 43,47.1 44.8,43.98 | C3.2 47.5,35.8 v47.4,35.9 | C1.1 45.6,42.6 44.8,43.98 | 27.6,34.7 27.6,33 27.9,33 29,31.9 29,30.89 C28.1 | C27.1 26.2,38.7 v26.5,38.4 27,37.9 27,36.3 26.7,36 | v19.1,39.1 18.7,39.1 18.4,38.8 | C23.1 44.63,43.8 44.8,43.98 | U$8.23 19.9,29 21.18,27.72
  Top 0.305: 21.18,27.72 21.18,24.9 C25.2 21.3,24.2 22,24.9 24,24.9 24.2,24.7 24.2,22.41 23.59,21.79 | U$3.23 38,21.7 v39.4,20.3 | 16.6,41.1 16.5,41.2 16.5,41.8 19.9,47.7 21.2,47.7 21.7,48.2 23,48.2 24.5,49.7 C4.1 25.1,48.5 25.9,47.7 27.8,47.7 28.4,48.3 | 28.4,48.3 28.4,49.4 U$2.3 | 28.4,48.3 28.41,48.29 C8.1 30.61,48.9 v31.6,48.9
  Bottom 0.254: v20.2,25.4 22,27.2 22,29 v22.4,29.4 22.5,29.3 23.2,29.3 24.8,27.7 28.2,27.7 v28.3,27.6 29,28.3 31.3,28.3 31.5,28.5 31.5,34.2 30.9,34.8 28.7,34.8 v28.3,35.2 | v47.4,35.9 48,35.9 49.1,34.8 | v42.5,47.6 42.5,48.5 42.4,48.6 U$5.P$1 | v30.6,19.6 31.3,19.6 33.8,17.1 40.4,17.1 42.8,20.9 | v26.5,38.4 25.4,38.4 25,38.8 19.4,38.8 v19.1,39.1 | PH4.P$3 44.5,26.3 45.36,25.44
  Bottom 0.305: v39.4,20.3 42.2,20.3 42.8,20.9 45.36,25.44 49,31.9 49.1,32 49.1,34.8 | v31.6,48.9 40.4,48.9 40.7,48.6 U$5.P$1
  pour Bottom (isolate 0.305): 11.5,34.1 21.4,51.1 41.3,51.1 51.3,33.9 41.3,16.7 26.5,16.7 26.5,25 16.5,25 11.5,34
GNDI  (via drill 0.5 pad 0.61)
  Top 0.254: C17.1 22.59,39.9 21.76,39.9 R15.2 | U$3.5 34.3,26.3 v34.4,26.4 | v32.8,27.1 32.4,27.1 32.2,26.9 31.8,26.9 31.6,26.7 31.6,23.8 31.7,23.7 U$3.9 | v39.1,28.2 39.1,28.4 40,29.3 41.1,29.3 | 41.1,29.3 41.4,29.3 v42.1,30 | IC1.2 43.7,35.98 43.7,34.5 44.1,34.1 D3.C 44.2,32 44.9,32 v46.2,30.7 | 23.96,44.66 23.76,44.66 23.7,44.6 | 23.7,42.8 v24.5,42.8 | D2.C 42.25,22.15 D4.C 41.35,23.55 40.4,24.5 D1.C 40.4,26.5 41.2,27.3 41.2,29.2 41.1,29.3 | R3.2 38.2,39.2 v38.9,38.5
  Top 0.305: IC1.1 IC1.2 | C17.1 24.18,39.89 R5.2 | R14.2 31.3,43.2 | R7.2 23.68,44.69 C18.1 21.79,44.69 21.5,44.4 | 21.76,39.9 21.5,40.16 21.5,42.1 21.8,42.4 23.3,42.4 23.7,42.8 23.7,44.6 R7.2 | R7.2 23.96,44.66 | 31.3,43.4 31.3,43.2 | R17.2 40.08,45.36 C20.1 41.1,44.39 41.1,40.9 40.59,40.39 C16.1 39.77,40.36 | R3.2 39.77,40.36 | 31.3,43.4 31.5,43.2 R12.2 31.3,43.2 | 39.77,40.36 39.84,40.36 40,40.2 40,35.2 39.5,34.7 35.24,34.7 R10.2 | 31.3,43.4 v31.2,44.2 | v46.2,30.7 46.2,28.9 PH4.P$2
  Top 0.406: IC1.1 v42.1,36
  Bottom 0.254: 34.1,26.4 v34.4,26.4 33.5,26.4 v32.8,27.1 32.8,28.9 33.2,29.3 34.6,29.3 35.7,28.2 v39.1,28.2 | v24.5,42.8 25.1,42.8 26,41.9 26.7,41.9 27.9,43.1 30.2,43.1 v31.2,44.2 | v42.1,30 42.2,30 43.1,30.9 46,30.9 v46.2,30.7 | v38.9,38.5 38.5,38.5 38.3,38.3
  Bottom 0.406: v42.1,36 40.5,36 38.3,38.2 38.3,38.3 38.3,39.7 34.5,43.5 32,43.5 v31.2,44.2
MISO  (via drill 0.5 pad 0.61)
  Top 0.254: U$8.29 22.31,32.29 25.6,29 25.6,24.2 v25.8,24 | v37.1,19.1 36.6,19.1 36.4,19.3 35.9,19.3 35.8,19.4 U$3.20
  Bottom 0.254: v25.8,24 25.8,23.7 26.2,23.3 29.9,23.3 30.3,22.9 32.6,22.9 33.9,21.6 33.9,20.5 34.6,19.8 36.4,19.8 v37.1,19.1
MOSI  (via drill 0.5 pad 0.61)
  Top 0.254: U$8.28 22.11,31.79 25.1,28.8 25.1,24.7 24.8,24.4 24.8,23.1 v25,22.9 | v38.1,18 38.1,19.6 37.6,20.1 36.45,20.1 U$3.21
  Bottom 0.254: v25,22.9 25.2,22.7 29.7,22.7 30,22.4 32.3,22.4 33.4,21.3 33.4,20.3 34.5,19.2 35.1,19.2 35.6,18.7 36.2,18.7 36.9,18 v38.1,18
N$1
  Top 0.254: U$8.22 19.4,28.7 20.2,27.9
  Top 0.305: FB3.1 19.4,26.23 FB2.1 19.52,26.2 20,26.2 20.2,26.4 20.2,27.9
N$2
  Top 0.254: U$8.3 19.4,38.08 C24.1
N$3
  Top 0.254: U$8.4 18.9,36.71 C21.2
N$4
  Top 0.254: C6.2 18.08,27.96 FB1.1 18.4,28.27 U$8.20
N$5  (via drill 0.5 pad 0.61)
  Top 0.254: R1.1 18.8,43.94 18.8,44.5 20.2,47 20.4,47.2 21.5,47.2 22,47.7 23.9,47.7 v24,47.8 | U$2.2 27.27,48.98 v26.8,48.5
  Top 0.305: U$1.2 18.38,43.51 R1.1
  Bottom 0.254: v26.8,48.5 24.7,48.5 v24,47.8
N$6  (via drill 0.5 pad 0.61)
  Top 0.254: U$8.25 21.15,29.35 22.1,28.4 22.9,28.4 v23.3,28 | R9.2 22.14,25.9 22.7,25.9 23,26.2 v23.4,25.8
  Bottom 0.254: 23.2,26 v23.4,25.8 23.3,25.9 v23.3,28
N$7
  Top 0.254: U$8.21 18.9,28.18 FB1.2
  Top 0.305: FB2.2 19.5,27.57 FB1.2
N$10
  Top 0.254: U$8.30 21.99,32.79 22.9,33.7 25.1,33.7 25.4,33.4 XTAL1.1 25.65,32.39 26.3,32.39 26.9,32.99 C5.2
N$11
  Top 0.254: U$8.31 21.79,33.29 23.1,34.6 23.46,34.6 XTAL1.3 23.8,34.94 23.8,35.7 24.5,36.4 C19.2
N$12
  Top 0.254: U$3.8 32.35,25.46 C9.1
N$14
  Top 0.254: U$3.16 33.8,19.6 33,18.8 30,18.8 29.6,19.2 27.9,19.2 27.4,19.7 27.4,19.95 XTAL2.3 25.11,20.3 24.73,20.68 C11.2
N$15
  Top 0.254: U$3.17 34.3,19.1 33.5,18.3 31.1,18.3 30.9,18.1 XTAL2.1 28.75,17.85 27.9,17 25.5,17 24.48,18.02 C12.2
N$18
  Top 0.254: R2.1 46.26,34.3 44.9,34.3 44.33,34.88 IC1.3 44.33,37.23 44.7,37.6 46.26,37.6 R19.2 46.36,37.56 47,38.2 47.69,38.2 C15.2
N$22
  Top 0.305: FB3.2 17.82,24.69 C14.2
P0B
  Top 0.254: R10.1 34.76,33.16 33.95,32.35
  Top 0.305: IC2.16 33,33.3 33.95,32.35 34.6,31.7 34.6,29.8 35.56,28.84 U1.10
P1B  (via drill 0.5 pad 0.61)
  Top 0.254: U1.7 30.34,27.54 v30.2,27.4 | v32.1,37.1 32.5,37.1 32.75,36.85
  Top 0.305: IC2.5 32,36.1 32.75,36.85 33.5,37.6 33.5,43.16 R12.1
  Bottom 0.254: v30.2,27.4 30.2,27.3 30.4,27.1 31.4,27.1 32,27.7 32,37 v32.1,37.1
P2B  (via drill 0.5 pad 0.61)
  Top 0.254: U1.13 35.91,30.8 v35.4,31.3
  Top 0.305: v28,41.7 29.06,42.76 R14.1 29.6,42.66 29.6,40.7 29.8,40.5 29.8,36.7 30.25,36.25 IC2.8
  Bottom 0.254: v35.4,31.3 35.4,39 33.9,40.5 30.6,40.5 29.8,41.3 28.4,41.3 v28,41.7
P3B  (via drill 0.5 pad 0.61)
  Top 0.254: v25.7,37.4 25.2,37.4 24.84,37.76 R15.1 | v29.5,32.6 30.25,32.6
  Top 0.305: IC2.13 30.25,32.6 30.25,31.05 30.5,30.8 U1.2
  Bottom 0.254: v25.7,37.4 26.9,36.2 26.9,33.5 27.8,32.6 v29.5,32.6
SCL  (via drill 0.5 pad 0.61)
  Top 0.254: U$8.10 15.71,33.29 15.4,33.6 15.4,35.5 v15.3,35.6 15.3,37.7 15.7,38.1 16.54,38.1 R16.1 | U1.4 27.8,29.5 v27.6,29.3
  Bottom 0.254: v15.3,35.6 15.3,35.1 15.8,34.6 16.2,34.6 18.5,32.3 26,32.3 27.4,30.9 27.4,29.5 v27.6,29.3
SCLK  (via drill 0.5 pad 0.61)
  Top 0.254: U$8.18 17.4,28.6 v17.2,28.4 | U$3.19 35.3,18 35.7,18 v35.8,17.9
  Bottom 0.254: v17.2,28.4 17.2,28.3 19.1,25.5 19.8,24.5 20.4,23.9 21.9,23.9 23.8,22 29.5,22 29.6,21.9 31.9,21.9 32.8,21 32.8,20.1 34.2,18.7 34.8,18.7 35.6,17.9 v35.8,17.9
SDA  (via drill 0.5 pad 0.61)
  Top 0.254: U$8.11 15.21,32.79 15.1,32.9 15.1,33.3 14.6,33.8 14.6,34.7 v14.4,34.9 | U1.5 28.34,28.84 28,28.5 27.2,28.5 26.7,29 26.7,29.6 26.2,30.1 26.2,30.5 v26.1,30.6 | 14.46,34.96 v14.4,34.9 | R11.2 14.56,36.56 14.4,36.4 v14.4,34.9
  Bottom 0.254: v14.4,34.9 14.7,34.9 17.9,31.7 25,31.7 v26.1,30.6
VCC  (via drill 0.5 pad 0.61)
  Top 0.254: U$8.24 20.4,29.24 R9.1 22.46,27.54 23,27 23.7,27 23.75,27.05 | U$8.27 21.91,31.29 22.5,30.7 22.5,30.4 24.2,28.7 24.2,27.5 23.75,27.05 | U$3.12 30.7,22.2 29,23.9 28.5,23.9 | v24.3,26.7 24.1,26.7 23.75,27.05 | U$3.24 38.7,22.2 40.1,20.8 41.8,20.8 42,20.6 42,20.2 | v32,17.5 32.4,17.1 39,17.1 40.8,18.9 41.6,18.9 42,19.3 42,20.2 | v22.7,19.1 22.7,22.8 v23.4,23.5 | U$8.9 16.15,35.65 16.2,35.7 v16.4,35.7 16.4,36 16.3,36.1 16.3,36.84 R11.1 | U$8.2 19.9,35.8 20.2,36.1 v20.2,36.6 20.2,38.6 20.1,38.7 | 28.5,23.9 28,23.9 v27.2,24.7 C13.2 26.59,26.4 26.2,26.4 26.2,29.3 25,30.5 25,30.8 25.7,31.5 26.8,31.5 27.3,31 | 20.1,38.7 20.1,40.1 19.9,40.3 C2.2 | C2.2 19.8,40.1 | U$1.4 19.23,41.38 19.5,41.1 19.5,40.11 C2.2 | C7.2 28.7,24.1 28.5,23.9 | R16.2 16.6,39.8 16.7,39.8 v17.6,38.9 | U1.12 38.16,30.16 38.2,30.2 38.2,33.2 38.4,33.4 v42.9,33.4 | 42,20.2 42.8,20.2 48.2,29.9 v46.1,32 46.72,32.62 C3.1 | C27.2 20.1,38.7 | C28.2 27.19,30.89 27.3,31 | 27.3,31 v28,31.7
  Top 0.305: C4.2 21.9,49.7 v20.8,48.6 | v20.3,42 19.65,42 U$1.4
  Bottom 0.254: v32,17.5 31.2,17.5 29.8,18.9 22.9,18.9 v22.7,19.1 | v23.4,23.5 23.4,24.1 24.3,25 v24.3,26.7 25.2,26.7 v27.2,24.7 | v16.4,35.7 18.1,35.7 | 18.1,35.7 19.3,35.7 v20.2,36.6 20.2,36.5 23.3,33.4 26.1,33.4 27.8,31.7 v28,31.7 | 18.1,35.7 17.6,36.2 v17.6,38.9 | v42.9,33.4 44.7,33.4 v46.1,32
  Bottom 0.305: v20.8,48.6 20.8,42.5 v20.3,42
VDD  (via drill 0.5 pad 0.61)
  Top 0.254: U$3.11 31.1,22.7 30.3,23.5 v30.3,24 | v39.6,22.7 U$3.25 | IC2.2 33.05,34.45 34.4,35.8 38.9,35.8 v39,35.7 | v42.7,42.4 43.02,42.08 IC1.8 43.02,39.38 43.4,39 46.06,39 R19.1 46.16,39.38 C1.2 | C23.2 42.7,43.8
  Top 0.305: U$2.4 29.07,50.12 29.29,49.91 C8.2 33.59,49.91 34.7,48.8 40.2,48.8 42.7,46.3 42.7,43.8 v42.7,42.4
  Bottom 0.254: v39,35.7 39.2,35.7 41.35,33.55 | 41.35,33.55 42.1,32.8 42.1,31.6 41.3,30.8 41.3,28 41.5,27.8 42.1,27.2 42.1,23.6 41.2,22.7 v39.6,22.7 35,22.7 34.2,23.5 30.8,23.5 v30.3,24 | v42.7,42.4 43.1,42.4 43.6,41.9 43.6,35.8 41.35,33.55
  Bottom 0.305: PH4.P$1 42.2,28.5 41.5,27.8
VIN  (via drill 0.5 pad 0.61)
  Top 0.254: C10.2 37.32,50.52 v36.7,49.9
  Top 0.305: U$1.1 19.12,42.42 20.44,43.74 R1.2 20.84,43.5 v22.2,43.5 | v26.5,50.2 26.57,50.12 U$2.1 27.27,50.58 27.5,50.8 35.8,50.8 v36.7,49.9
  Bottom 0.305: v26.5,50.2 23.6,50.2 23,49.6 23,44.3 v22.2,43.5 | v36.7,49.9 38.7,49.9 39.1,50.3 U$4.P$1